# EAGLE design hackeeg-connector-12 (EAGLE 9.4.0)
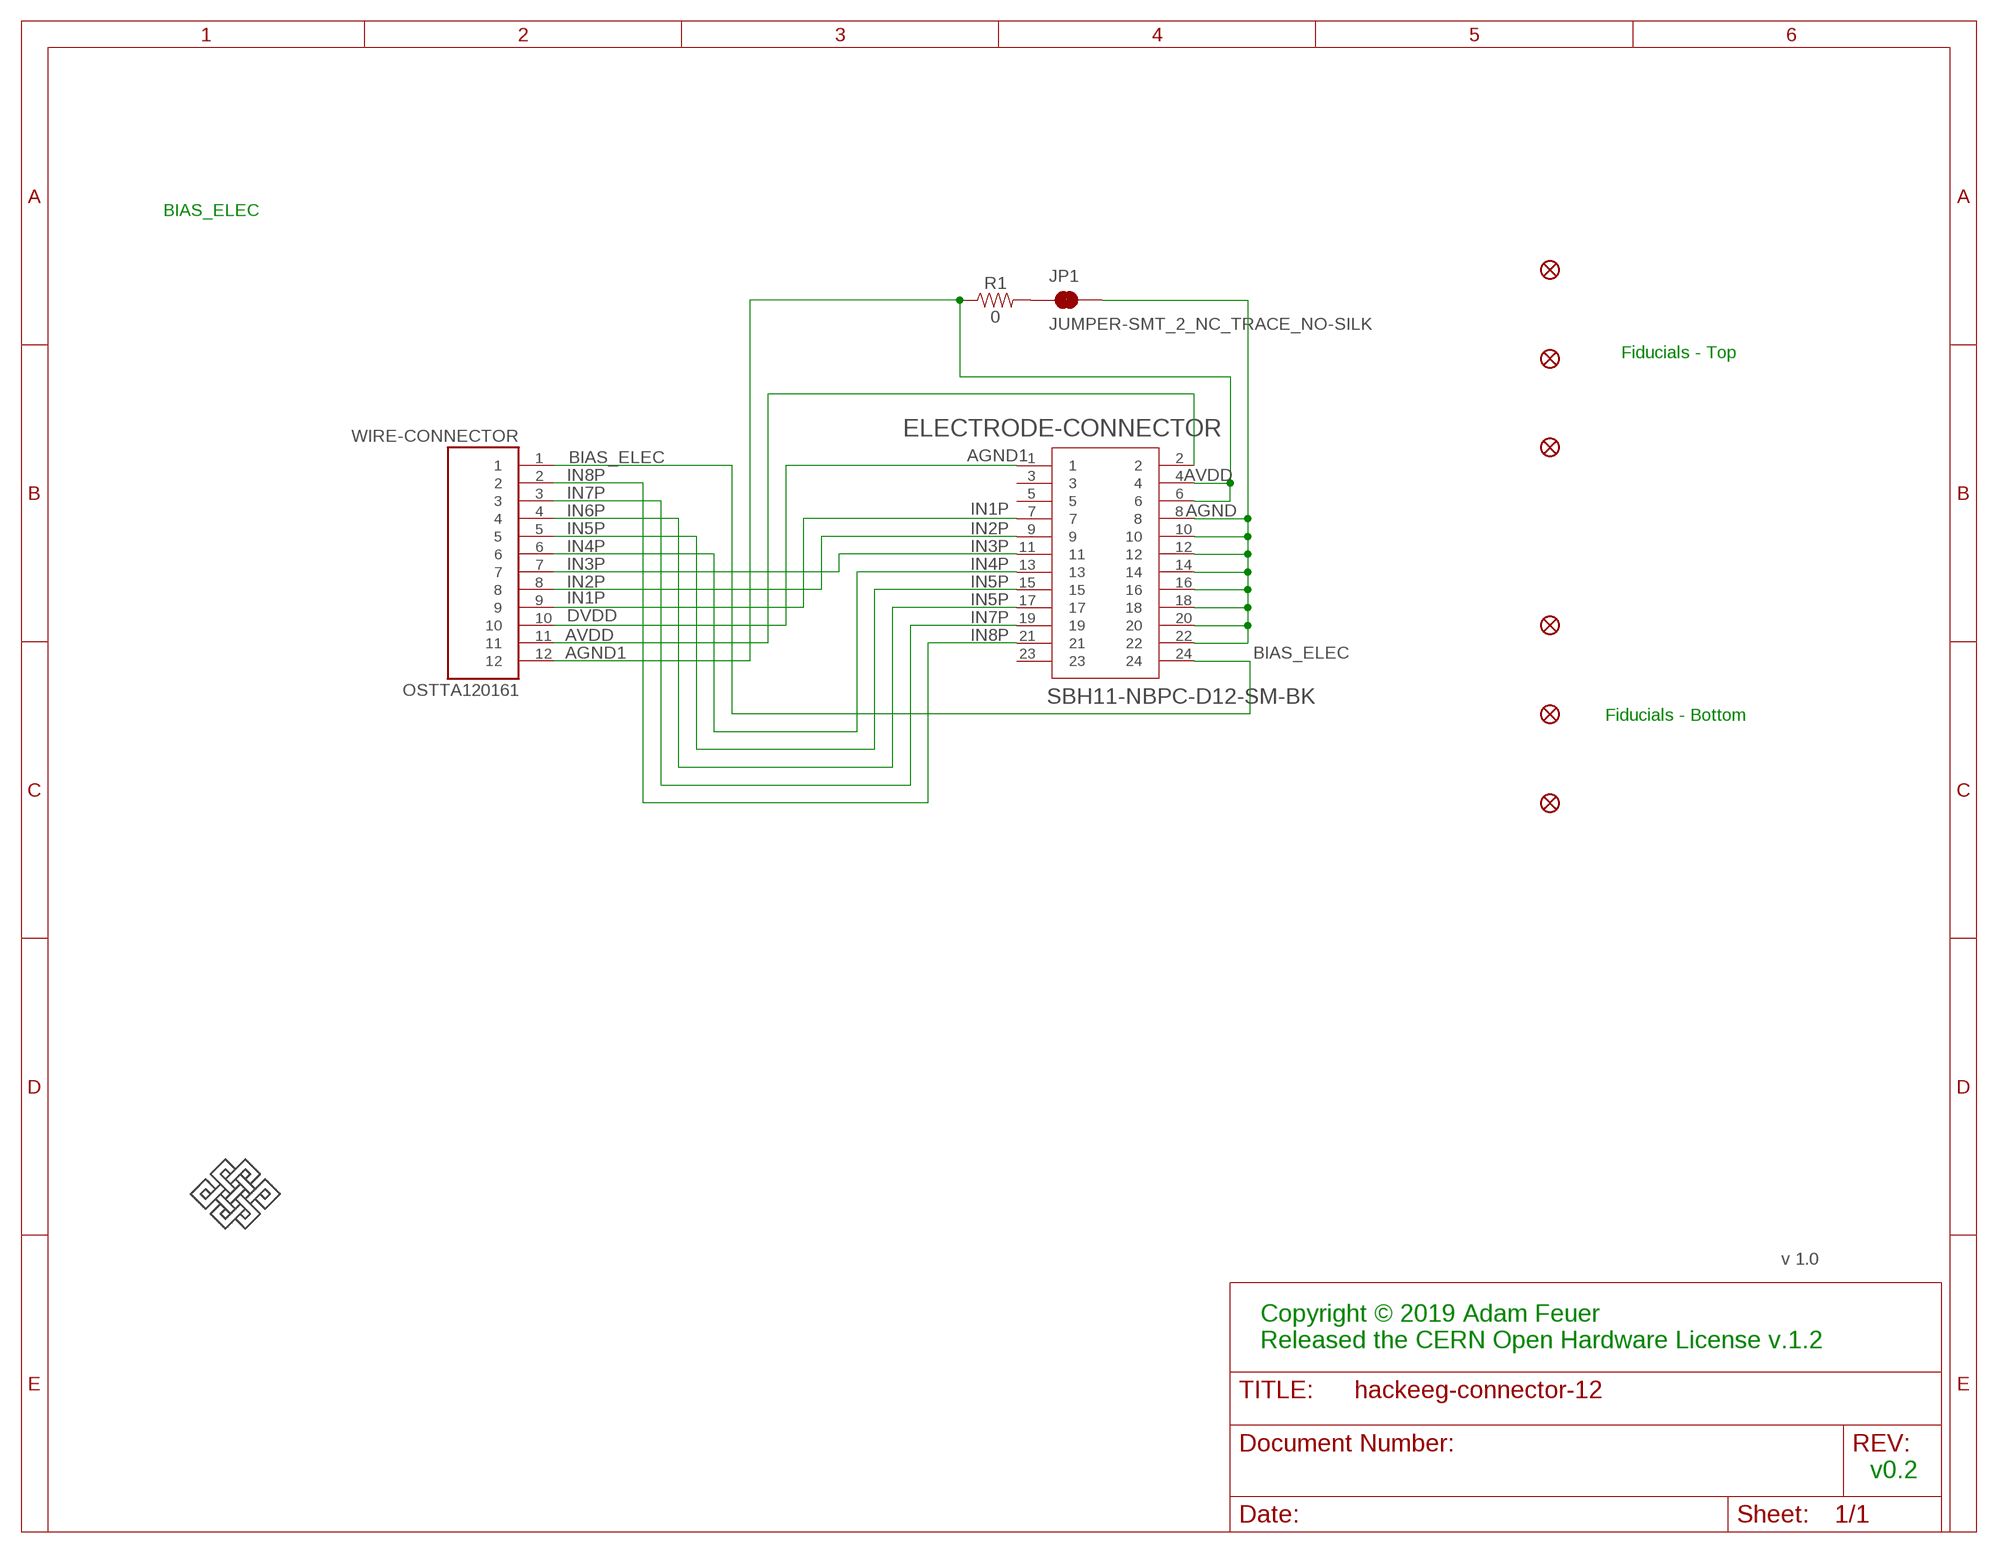
[diagram p0: schematic, sheet 1]

## Parts
ELECTRODE-CONNECTOR  SBH11-NBPC-D12-SM-BK  [SULLINS_SBH11-NBPC-D12-SM-BK]
FD1  FIDUCIAL1X2  [FIDUCIAL-1X2]
FD2  FIDUCIAL1X2  [FIDUCIAL-1X2]
FD3  FIDUCIAL1X2  [FIDUCIAL-1X2]
FD4  FIDUCIAL1X2  [FIDUCIAL-1X2]
FD5  FIDUCIAL1X2  [FIDUCIAL-1X2]
FD6  FIDUCIAL1X2  [FIDUCIAL-1X2]
JP1  JUMPER-SMT_2_NC_TRACE_NO-SILK  [SMT-JUMPER_2_NC_TRACE_NO-SILK]
R1  0  0OHM-0603-1/10W-5%  [0603]
U$1  ENDLESSKNOTENDLESSKNOT-MEDIUM  [ENDLESSKNOT-MEDIUM]
WIRE-CONNECTOR  OSTTA120161  [ONSHORE_OSTTA120161]

## Nets
AGND: ELECTRODE-CONNECTOR.8 ELECTRODE-CONNECTOR.10 ELECTRODE-CONNECTOR.12 ELECTRODE-CONNECTOR.14 ELECTRODE-CONNECTOR.16 ELECTRODE-CONNECTOR.18 ELECTRODE-CONNECTOR.20 ELECTRODE-CONNECTOR.22 JP1.2
AGND1: ELECTRODE-CONNECTOR.4 ELECTRODE-CONNECTOR.6 R1.1 WIRE-CONNECTOR.12
AVDD: ELECTRODE-CONNECTOR.2 WIRE-CONNECTOR.11
BIAS_ELEC: ELECTRODE-CONNECTOR.24 WIRE-CONNECTOR.1
DVDD: ELECTRODE-CONNECTOR.1 WIRE-CONNECTOR.10
IN1P: ELECTRODE-CONNECTOR.7 WIRE-CONNECTOR.9
IN2P: ELECTRODE-CONNECTOR.9 WIRE-CONNECTOR.8
IN3P: ELECTRODE-CONNECTOR.11 WIRE-CONNECTOR.7
IN4P: ELECTRODE-CONNECTOR.13 WIRE-CONNECTOR.6
IN5P: ELECTRODE-CONNECTOR.15 WIRE-CONNECTOR.5
IN6P: ELECTRODE-CONNECTOR.17 WIRE-CONNECTOR.4
IN7P: ELECTRODE-CONNECTOR.19 WIRE-CONNECTOR.3
IN8P: ELECTRODE-CONNECTOR.21 WIRE-CONNECTOR.2
N$17: JP1.1 R1.2
Unconnected: ELECTRODE-CONNECTOR.3 ELECTRODE-CONNECTOR.5 ELECTRODE-CONNECTOR.23

## Notes on the sheet
- BIAS_ELEC
- Fiducials - Top
- AGND1
- AVDD
- IN1P
- IN2P
- IN3P
- IN4P
- IN5P
- IN5P
- IN7P
- IN8P
- BIAS_ELEC
- Fiducials - Bottom
- v 1.0
- Copyright © 2019 Adam Feuer
  Released the CERN Open Hardware License v.1.2
- v0.2

## Library data of the parts
ELECTRODE-CONNECTOR = SBH11-NBPC-D12-SM-BK:SBH11-NBPC-D12-SM-BK: Conn Headr 2.54mm 24pos Gold Smd; AVAILABILITY: Warning; DESCRIPTION: Conn Headr 2.54mm 24pos Gold Smd; MF: Sullins Connector; MP: SBH11-NBPC-D12-SM-BK; PACKAGE: None; PRICE: 1.05 USD
FD1-FD6 = SparkFun-Aesthetics:FIDUCIAL: Fiducial Alignment Points Point-of-reference for pick-and-place machines and other optical instruments.
JP1 = SparkFun-Jumpers:JUMPER-SMT_2_NC_TRACE: Normally closed trace jumper This jumper has a trace between two pads so it's normally closed (NC). Use a razor knife to open the connection. For best results follow the IPC guidelines for cutting traces: Cutout at least 0.063 mm (0.005 in). Remove all loose material to clean up the cut area. Seal the cut with an approved epoxy. Reapply solder to reclose the connection.
R1 = SparkFun-Resistors:0OHM: 0Ω resistor A resistor is a passive two-terminal electrical component that implements electrical resistance as a circuit element. Resistors act to reduce current flow, and, at the same time, act to lower voltage levels within circuits. - Wikipedia; PROD_ID: RES-08609
U$1 = endless-knot:ENDLESSKNOT
WIRE-CONNECTOR = OSTTA120161:OSTTA120161: TERM BLK 12P SIDE ENTRY 5MM PCB; AVAILABILITY: Unavailable; DESCRIPTION: TERM BLK 12P SIDE ENTRY 5MM PCB; MF: On Shore Technology Inc.; MP: OSTTA120161B; PACKAGE: None; PRICE: None

## Board
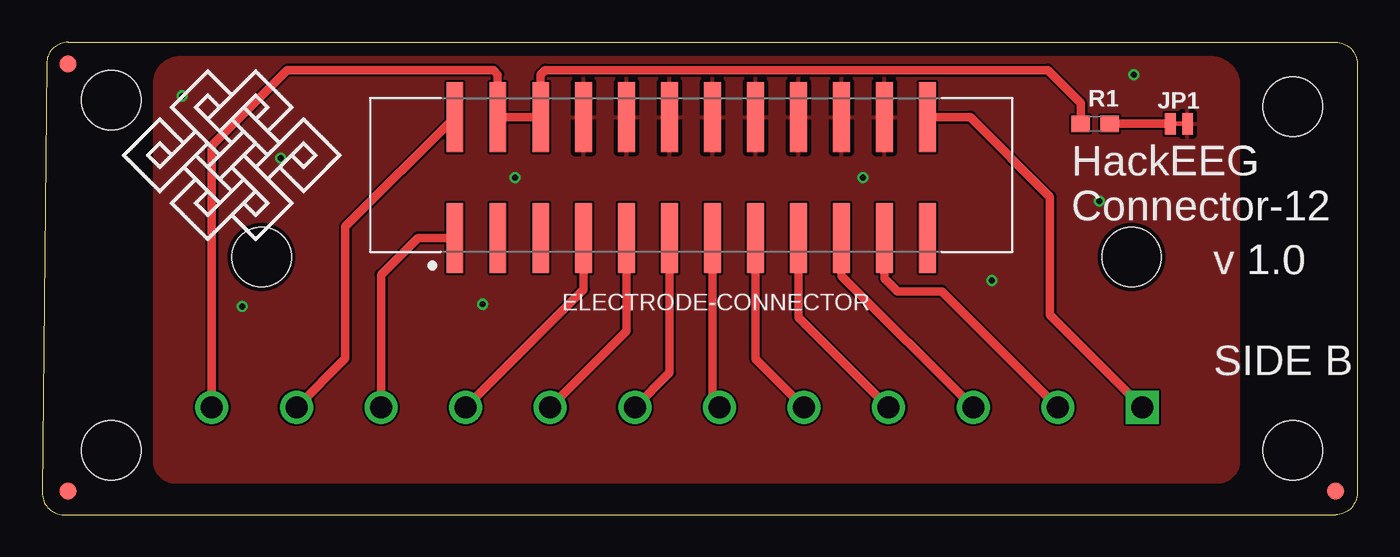
[diagram p1: board, top side]
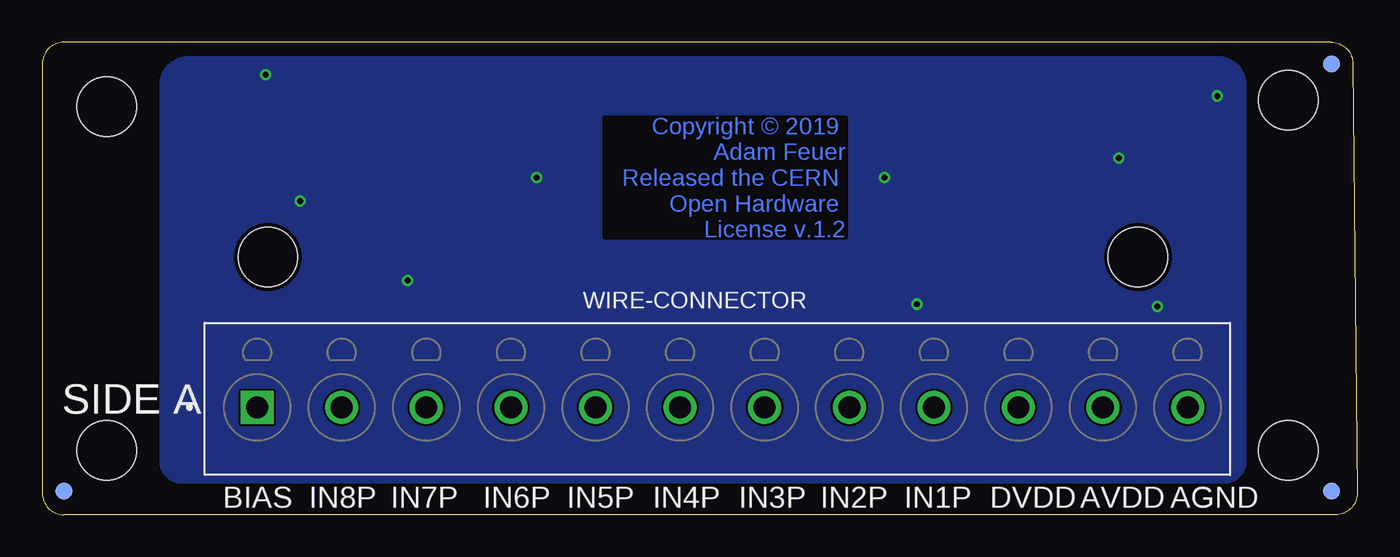
[diagram p2: board, bottom side, seen from below]

Size 77.73 x 27.94 mm. Coordinates in mm from the lower left corner, seen from the top.
Outline: 0.26,26.67 0,1.28 arc91 1.27,0 76.46,0 arc90 77.73,1.27 77.73,26.67 arc90 76.46,27.94 1.53,27.94 arc90 0.26,26.67
Copper layers (1*16): Top 0.035mm / dielectric 1.5mm / Bottom 0.035mm
Design rules "MF_Standard_2_Layer": minimum track width 5mil, minimum drill 12mil, track to track 5mil, track to pad 5mil, pad to pad 5mil, via to via 5mil, smd to smd 0mil, copper to edge 10mil, drill to drill 10mil, minimum pad ring 6mil, minimum via ring 6mil, stop-mask expansion 2mil, vias tented up to drill 25mil, thermal gap 10mil
Holes 3.5 mm at 4.07,24.51 4.07,3.81 73.92,3.81 73.92,24.13 12.96,15.24 64.39,15.24

### Footprints (pad centres in the part's own frame; a part is rotated, then mirrored left to right if it is on the bottom)
SULLINS_SBH11-NBPC-D12-SM-BK = smd 1 x 4.15: 1 -13.97,-3.575; 2 -13.97,3.575; 3 -11.43,-3.575; 4 -11.43,3.575; 5 -8.89,-3.575; 6 -8.89,3.575; 7 -6.35,-3.575; 8 -6.35,3.575; 9 -3.81,-3.575; 10 -3.81,3.575; 11 -1.27,-3.575; 12 -1.27,3.575; 13 1.27,-3.575; 14 1.27,3.575; 15 3.81,-3.575; 16 3.81,3.575; 17 6.35,-3.575; 18 6.35,3.575; 19 8.89,-3.575; 20 8.89,3.575; 21 11.43,-3.575; 22 11.43,3.575; 23 13.97,-3.575; 24 13.97,3.575
FIDUCIAL-1X2 = smd 1 x 1: 1 0,0
SMT-JUMPER_2_NC_TRACE_NO-SILK = smd 0.635 x 1.27: 1 -0.508,0; 2 0.508,0
0603 = smd 1.1 x 1: 1 -0.85,0; 2 0.85,0
ONSHORE_OSTTA120161 = drill 1.3 square: 1 0,0 | drill 1.3: 2 5,0; 3 10,0; 4 15,0; 5 20,0; 6 25,0; 7 30,0; 8 35,0; 9 40,0; 10 45,0; 11 50,0; 12 55,0

### Placement (x,y rotation side)
ELECTRODE-CONNECTOR  38.36,19.94 0 top
FD1  1.53,1.4 0 top
FD2  1.53,26.67 0 top
FD3  76.46,1.4 0 top
FD4  76.46,1.4 0 bottom
FD5  1.53,26.67 0 bottom
FD6  1.53,1.4 0 bottom
JP1  67.19,23.11 0 top
R1  62.23,23.11 0 top
U$1  11.31,21.21 0 top
WIRE-CONNECTOR  65.03,6.35 0 bottom

### Tracks (layer width: path | path; a pad name or v marks a point on that pad's centre or on a via)
AGND  (via drill 0.35)
  other vias: 8.26,24.77 14.1,21.08 27.94,19.94 48.52,19.94 56.14,13.84 64.52,26.04 26.04,12.45 11.81,12.32 62.49,18.54
  pour Top: 8.13,27.05 69.09,27.05 arc-90 70.74,25.4 70.74,3.17 arc-90 69.47,1.91 7.88,1.91 arc-90 6.61,3.17 6.61,25.53 arc-90
  pour Bottom: 6.61,21.46 6.61,7.75 6.61,3.17 arc90 7.88,1.91 69.47,1.91 arc90 70.74,3.17 70.74,11.94 70.74,25.4 arc90 69.09,27.05 8.26,27.05 arc90 6.61,25.4
AGND1
  Top 0.508: ELECTRODE-CONNECTOR.4 ELECTRODE-CONNECTOR.6 29.47,26.04 29.72,26.29 59.44,26.29 61.38,24.35 R1.1 | 26.93,24.13 26.93,25.02 26.93,24.13 | ELECTRODE-CONNECTOR.4 26.93,24.13 | ELECTRODE-CONNECTOR.4 26.93,24.13 | ELECTRODE-CONNECTOR.4 26.93,26.04 26.67,26.29 14.48,26.29 10.03,21.84 WIRE-CONNECTOR.12
AVDD
  Top 0.508: ELECTRODE-CONNECTOR.2 17.91,17.04 17.91,9.23 WIRE-CONNECTOR.11
BIAS_ELEC
  Top 0.508: ELECTRODE-CONNECTOR.24 54.85,23.51 59.57,18.8 59.57,11.81 WIRE-CONNECTOR.1
DVDD
  Top 0.508: ELECTRODE-CONNECTOR.1 22.21,16.36 20.03,14.18 WIRE-CONNECTOR.10
IN1P
  Top 0.508: WIRE-CONNECTOR.9 32.01,13.33 ELECTRODE-CONNECTOR.7
IN2P
  Top 0.508: WIRE-CONNECTOR.8 34.55,10.87 ELECTRODE-CONNECTOR.9
IN3P
  Top 0.508: WIRE-CONNECTOR.7 37.09,8.41 ELECTRODE-CONNECTOR.11
IN4P
  Top 0.508: WIRE-CONNECTOR.6 39.63,6.75 ELECTRODE-CONNECTOR.13
IN5P
  Top 0.508: WIRE-CONNECTOR.5 42.17,9.21 ELECTRODE-CONNECTOR.15
IN6P
  Top 0.508: WIRE-CONNECTOR.4 44.71,11.67 ELECTRODE-CONNECTOR.17
IN7P
  Top 0.508: WIRE-CONNECTOR.3 47.25,14.13 ELECTRODE-CONNECTOR.19
IN8P
  Top 0.508: ELECTRODE-CONNECTOR.21 49.79,13.97 50.55,13.21 53.17,13.21 WIRE-CONNECTOR.2
N$17
  Top 0.508: JP1.1 R1.2

### Text on the board
Bottom: Copyright © 2019 / Adam Feuer / Released the CERN / Open Hardware / License v.1.2
tNames: HackEEG / Connector-12 | v 1.0 | SIDE B
bNames: SIDE A | AGND | AVDD | DVDD | IN1P | IN2P | IN3P | IN4P | IN5P | IN6P | IN7P | IN8P | BIAS